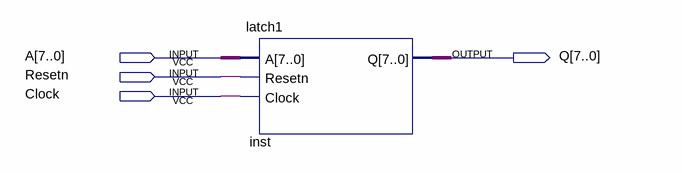
[diagram p0: schematic sheet]
// Quartus schematic LatchDiagram.bdf as structural Verilog: 1 symbols, 4 pins
module LatchDiagram (
  input  [7:0] A,
  input  Resetn,
  input  Clock,
  output [7:0] Q
);

  latch1 inst (.A(A), .Resetn(Resetn), .Clock(Clock), .Q(Q));
endmodule
